# Altium schematic sheet Sheet3.SchDoc
size A4; Organization: Blinkinlabs, LLC
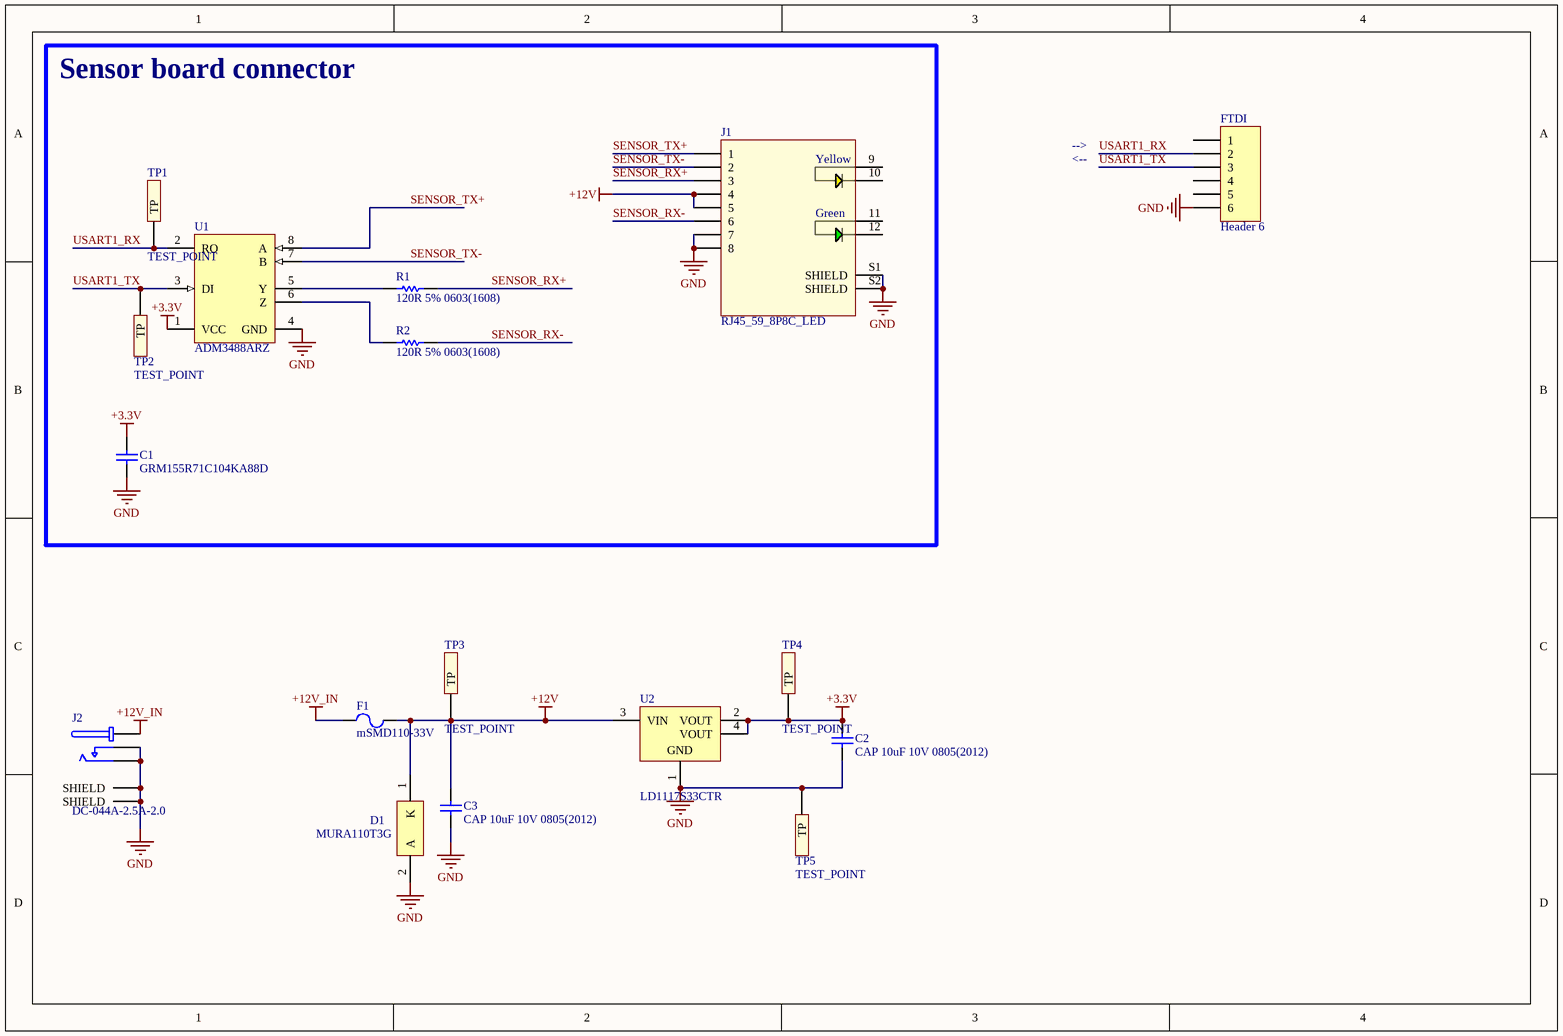
[diagram p0: Sheet3.SchDoc]

## Parts
C1  GRM155R71C104KA88D  [CAPC1005X55X25ML05T10]
C2  CAP 10uF 10V 0805(2012)  [CAPC0805(2012)145_N]
C3  CAP 10uF 10V 0805(2012)  [CAPC0805(2012)145_N]
D1  MURA110T3G  [ONSC-SMA-2-403D-02_V]
F1  mSMD110-33V  [SEAANDLAND_1812]
FTDI  Header 6  [HDR1X6]
J1  RJ45_59_8P8C_LED  [RJ45_59_8P8C_LED]
J2  DC-044A-2.5A-2.0  [DC-044A-2.5A-2.0]
R1  120R 5% 0603(1608)  [RESC0603(1608)_L]
R2  120R 5% 0603(1608)  [RESC0603(1608)_L]
TP1  TEST_POINT  [TP-SMD-1mm]  (no BOM)
TP2  TEST_POINT  [TP-SMD-1mm]  (no BOM)
TP3  TEST_POINT  [TP-SMD-1mm]  (no BOM)
TP4  TEST_POINT  [TP-SMD-1mm]  (no BOM)
TP5  TEST_POINT  [TP-SMD-1mm]  (no BOM)
U1  ADM3488ARZ  [ADI-R-8_L]
U2  LD1117S33CTR  [SOT-223_N]

## Blocks framed on the sheet
Sensor board connector: C1 J1 R1 R2 TP1 TP2 U1

## Nets
+3.3V: C1.2 C2.2 TP4.1(TP) U1.1(VCC) U2.2(VOUT) U2.4(VOUT)
+12V: C3.2 D1.1(K) F1.2 J1.4 J1.5 TP3.1(TP) U2.3(VIN)
+12V_IN: F1.1 J2.1
GND: C1.1 C2.1 C3.1 D1.2(A) FTDI.6 J1.7 J1.8 J1.S1(SHIELD) J1.S2(SHIELD) J2.2 J2.3 J2.4(SHIELD) J2.5(SHIELD) TP5.1(TP) U1.4(GND) U2.1(GND)
SENSOR_RX+: J1.3 R1.1
SENSOR_RX-: J1.6 R2.1
SENSOR_TX+: J1.1 U1.8(A)
SENSOR_TX-: J1.2 U1.7(B)
USART1_RX: FTDI.2 TP1.1(TP) U1.2(RO)
USART1_TX: FTDI.3 TP2.1(TP) U1.3(DI)
NetR1_2: R1.2 U1.5(Y)
NetR2_2: R2.2 U1.6(Z)

Not connected (* = marked no-connect by the designer): FTDI 1 4 5; J1 9(Yellow_Anode) 10(Yellow_Cathode) 11(Green_Anode) 12(Green_Cathode)

## Notes on the sheet
- <--
- -->
- Title:
- Project:
- Revision:
- Date:
- Time:
- Sheet
- of
- (in symbol RJ45_59_8P8C_LED) Yellow; Green

## Library data of the parts
C1 = CMP-2100-03641-1: Chip Capacitor, 0.1 uF, +/- 10%, 16 V, -55 to 125 degC, 0402 (1005 Metric), RoHS, Tape and Reel; Manufacturer: Murata; Material: Ceramic; Insulation Resistance: 10GR; Voltage: 16V; Dielectric: X7R; Capacitance: 100nF; REACH SVHC: NoSVHC; Depth: 0.5mm; Case/Package: 0402; Datasheet URL: http://psearch.en.murata.com/capacitor/product/GRM155R71C104KA88%23.pdf; Lead Free: LeadFree; Dielectric Material: Ceramic; Manufacturer URL: http://www.murata.com/; Min Operating Temperature: -55degC; Length: 1mm; Case Code (Metric): 1005; Radiation Hardening: No; Package Reference: 0402; RoHSCompliant: true; Datasheet Version: 42675.0; Thickness: 0.022inch; Packaging: TapeandReel; Voltage Rating (DC): 16V; Tolerance: 10%; Max Operating Temperature: 125degC; Package Description: 2-Pin Surface Mount Device, Body 1 x 0.5 mm; Mount: SurfaceMount; Height: 0.5mm; Width: 0.5mm; Number of Pins: 2; Voltage Rating: 16V; Case Code (Imperial): 0402; Termination: SMD/SMT; Package Quantity: 1
C2 C3 = CMP-1036-04922-1: CAP 10uF 10V ±10% 0805 (2012 Metric) Thickness 1.45mm SMD; Tolerance: Â±10%; Case-EIA: 0805; Case-Metric: 2012; Value: 10uF; Technology: SMT; Rated Voltage: 10 V; Max Thickness: 1.45 mm
D1 = CMP-0902-00293-1: Surface Mount Ultrafast Power Rectifier, 2-Pin SMA, Pb-Free, Tape and Reel; Manufacturer: On Semiconductor; IFSM Max (A): 50; Type: Ultrafast; PackageReference: SMA-2-403D-02; ComponentLink3URL: http://www.onsemi.com/pub_link/Collateral/403D-02.PDF; PackageDescription: 2-Pin Small Molded Package, J-Bend Lead, Body 2.605 x 4.315 mm; ComponentLink3Description: Package Specification; PartNumber: MURA110T3G; Mounting Technology: Surface Mount; RoHS: TRUE; DatasheetVersion: Rev. 5; ComponentLink1URL: http://www.onsemi.com/; Packing: Tape and Reel; ComponentLink1Description: Manufacturer URL; ComponentLink2Description: Datasheet; PackageVersion: Rev. G, 07/2012; ComponentLink2URL: http://www.onsemi.cn/pub_link/Collateral/MURA105T3-D.PDF
F1 = mSMD110-33V: Surface Mount Fuses 33V 100A 1.1A 2.2A 1812 RoHS; Manufacturer: Sea & Land Electronic Corp; PartNumber: mSMD110-33V; ComponentLink2Description: Datasheet; ComponentLink2URL: nSMD020-30V 0-2A-30V-Self-healing-fuse_C69680.pdf
FTDI = Header 6: Header, 6-Pin; LatestRevisionDate: 17-Jul-2002; LatestRevisionNote: Re-released for DXP Platform.; Publisher: Altium Limited
J1 = RJ45_59_8P8C_LED: Generic RJ49 jack with LED and without magnetics; Manufacturer: Unknown/Generic; PartNumber: RJ45_59_8P8C_LED
J2 = DC-044A-2.5A-2.0: DC Jack, 6mm OD, 2mm ID; Manufacturer: XKB; PartNumber: DC-044A-2.5A-2.0
R1 R2 = CMP-1012-00052-1: 120R 0.1W 5% 0603 (1608 Metric)  SMD; Case-EIA: 0603; Value: 120.00 Ohm; Case-Metric: 1608; Technology: SMT; Power: 0.1 W; Tolerance: 5 %
TP1-TP5 = TEST_POINT: Test point
U1 = CMP-0535-00058-1: 3.3 V Slew Rate Limited, Full-Duplex, RS-485/RS-422 Transceivers, 3 to 3.6 V, -40 to 85 degC, 8-Pin SOIC (R-8), RoHS, Tube; Manufacturer: Analog Devices; Guaranteed Data Rate: 0.25 Mbps; Receiver Hysteresis: 50 mV; Number of Drivers: 1; Duplex: Full; ComponentLink2URL: http://www.analog.com/static/imported-files/data_sheets/ADM3483_3485_3488_3490_3491.pdf; Mounting Technology: Surface Mount; RoHS: TRUE; ComponentLink2Description: Datasheet; ComponentLink3URL: http://www.analog.com/media/en/package-pcb-resources/package/pkg_pdf/soic_narrow-r/r_8.pdf; ComponentLink3Description: Package Specification; DatasheetVersion: Rev. E; PackageDescription: 8-Pin Standard Small Outline Package, Body 4.9 x 3.9 mm, Pitch 1.27 mm; ComponentLink1Description: Manufacturer URL; Supply Voltage: 3 to 3.6 V; PackageVersion: 06/2006; PartNumber: ADM3488ARZ; Packing: Tube; ComponentLink1URL: http://www.analog.com/en/index.html; Temperature Range: -40 to 85 degC
U2 = CMP-0244-00307-1: Fixed Low Drop Positive Voltage Regulator, 3.3V, 4-Pin SOT-223, Tape and Reel; ComponentLink1URL: http://www.st.com; PackageVersion: 2010; ComponentLink1Description: Manufacturer URL; DatasheetVersion: 1/11/2011; ComponentLink2URL: http://www.st.com/internet/com/TECHNICAL_RESOURCES/TECHNICAL_LITERATURE/DATASHEET/CD00000544.pdf; PackageReference: SOT-223; ComponentLink2Description: Datasheet; PackageDescription: 4-Pin SOT-223 Package, 6.5 x 3.5 mm Body, 2.3 mm Pitch, 7 mm Lead Span